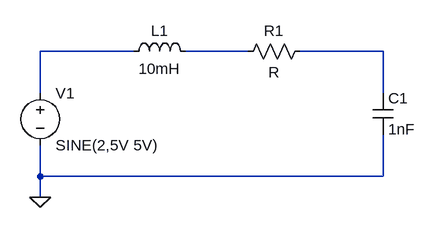
[diagram p0: schematic ex5.asc]
ex5.asc, the LTspice schematic file:
Version 4
SHEET 1 880 680
WIRE 64 48 -80 48
WIRE 240 48 144 48
WIRE 448 48 320 48
WIRE -80 112 -80 48
WIRE 448 112 448 48
WIRE -80 240 -80 192
WIRE 448 240 448 176
WIRE 448 240 -80 240
WIRE -80 272 -80 240
FLAG -80 272 0
SYMBOL voltage -80 96 R0
WINDOW 123 0 0 Left 0
WINDOW 39 0 0 Left 0
SYMATTR InstName V1
SYMATTR Value SINE(2,5V 5V)
SYMBOL ind 48 64 R270
WINDOW 0 32 56 VTop 2
WINDOW 3 5 56 VBottom 2
SYMATTR InstName L1
SYMATTR Value 10mH
SYMBOL res 336 32 R90
WINDOW 0 0 56 VBottom 2
WINDOW 3 32 56 VTop 2
SYMATTR InstName R1
SYMBOL cap 432 112 R0
SYMATTR InstName C1
SYMATTR Value 1nF

The netlist it stands for:
* ex5.asc
V1 N001 0 SINE(2,5V 5V)
L1 N001 N002 10mH
R1 N003 N002 R
C1 N003 0 1nF
.backanno
.end